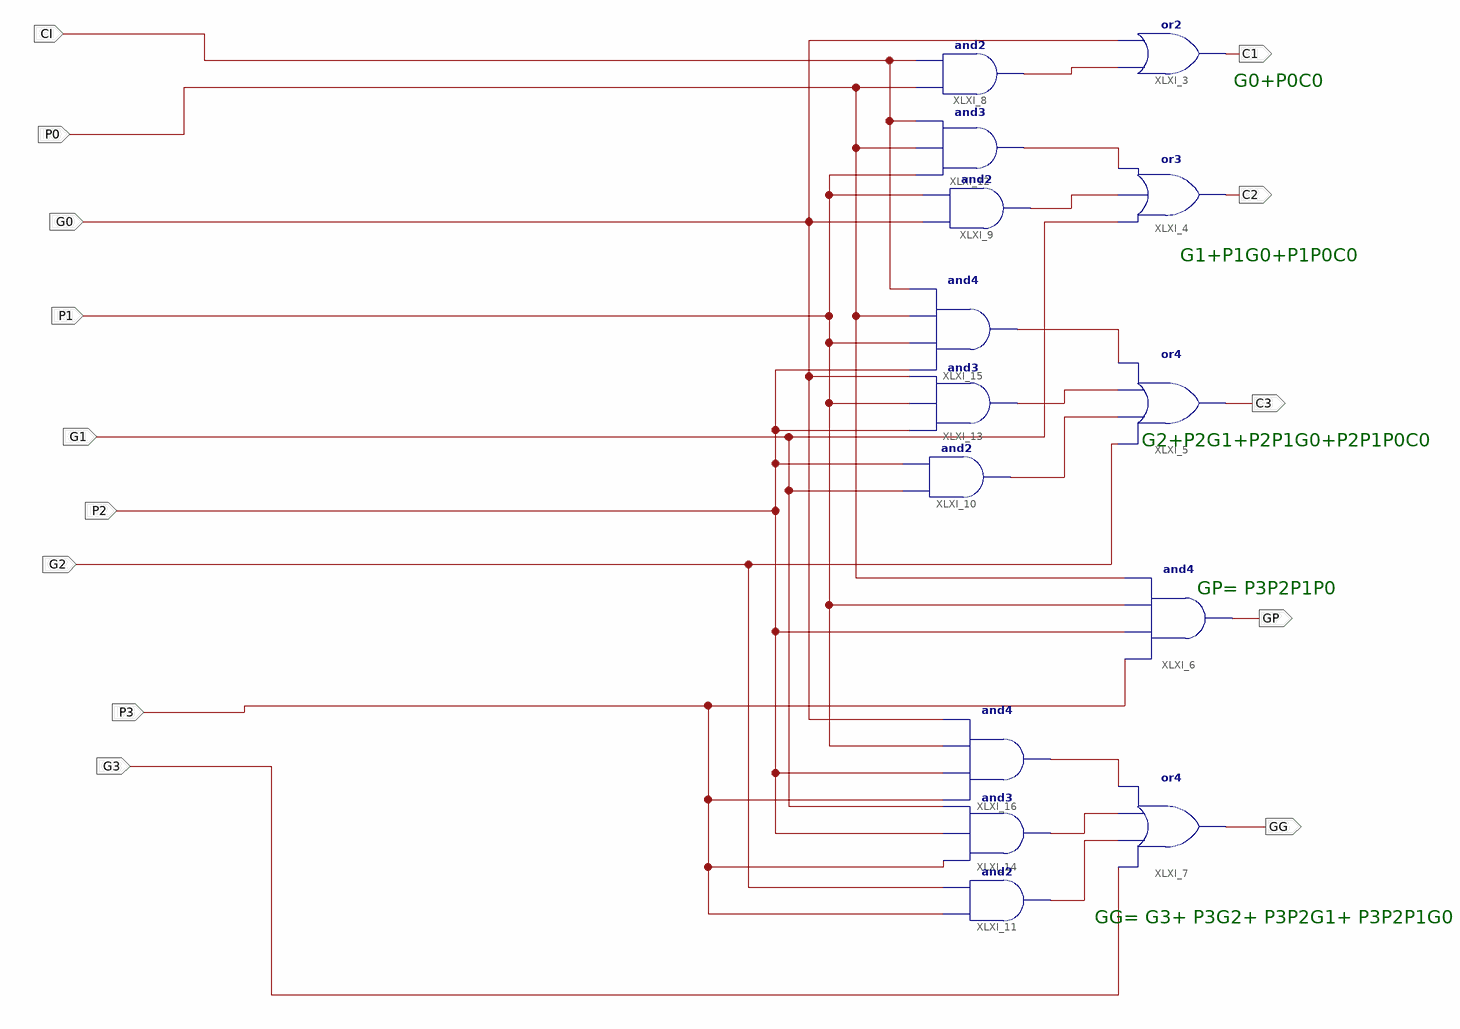
[diagram p0: schematic sheet 1]
// Xilinx ISE schematic CLA.sch (kintex7) as structural Verilog: 14 symbols, 14 ports
module CLA (
  input  CI,
  input  P0,
  input  P1,
  input  G1,
  input  P2,
  input  G2,
  input  P3,
  input  G3,
  input  G0,
  output C1,
  output C2,
  output C3,
  output GP,
  output GG
);

  wire XLXN_19, XLXN_21, XLXN_25, XLXN_33, XLXN_34, XLXN_35, XLXN_44, XLXN_45, XLXN_46;

  or XLXI_3 (C1, XLXN_19, G0);
  or XLXI_4 (C2, G1, XLXN_21, XLXN_25);
  or XLXI_5 (C3, G2, XLXN_33, XLXN_34, XLXN_35);
  and XLXI_6 (GP, P3, P2, P1, P0);
  or XLXI_7 (GG, G3, XLXN_46, XLXN_45, XLXN_44);
  and XLXI_8 (XLXN_19, P0, CI);
  and XLXI_9 (XLXN_21, G0, P1);
  and XLXI_10 (XLXN_33, G1, P2);
  and XLXI_11 (XLXN_46, P3, G2);
  and XLXI_12 (XLXN_25, P1, P0, CI);
  and XLXI_13 (XLXN_34, P2, P1, G0);
  and XLXI_14 (XLXN_45, P3, P2, G1);
  and XLXI_15 (XLXN_35, P2, P1, P0, CI);
  and XLXI_16 (XLXN_44, P3, P2, P1, G0);

  // Notes on the sheet:
  //   G0+P0C0
  //   G1+P1G0+P1P0C0
  //   G2+P2G1+P2P1G0+P2P1P0C0
  //   GP= P3P2P1P0
  //   GG= G3+ P3G2+ P3P2G1+ P3P2P1G0
endmodule
